# EAGLE schematic Battery_status (EAGLE 7.2.0)
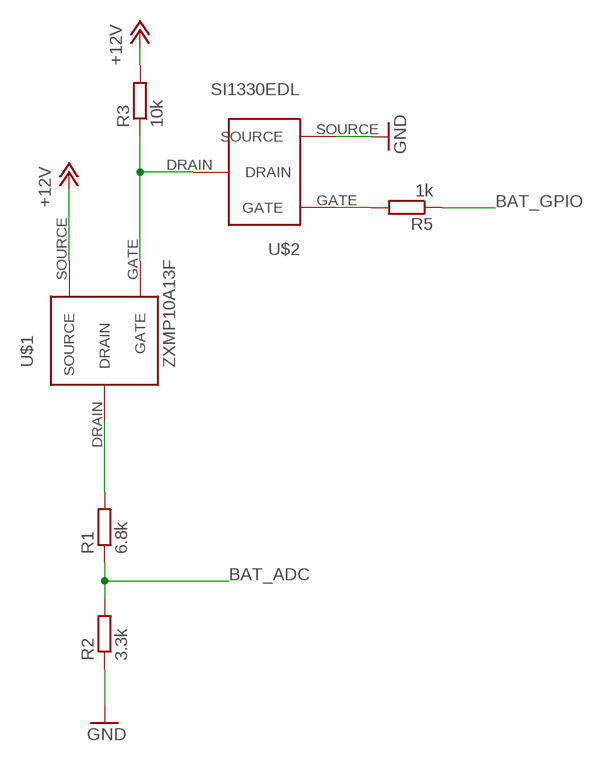
[diagram p0: schematic, sheet 1]

## Parts
R1  6.8k  R-EU_R0805  [R0805]
R2  3.3k  R-EU_R0805  [R0805]
R3  10k  R-EU_R0805  [R0805]
R5  1k  R-EU_R0805  [R0805]
U$1  ZXMP10A13F  [P-CHANNEL]
U$2  SI1330EDL  [SOT-323]

## Nets
+12V: R3.2 U$1.SOURCE
BAT_ADC: R1.1 R2.2
BAT_GPIO: R5.1
GND: R2.1 U$2.SOURCE
N$1: R1.2 U$1.DRAIN
N$2: R3.1 U$1.GATE U$2.DRAIN
N$3: R5.2 U$2.GATE

## Library data of the parts
R1-R3 R5 = rcl:R-EU_: RESISTOR, European symbol
U$1 = ZXMP10A13F:ZXMP10A13F
U$2 = SI1330EDL:SI1330EDL